# Altium schematic sheet Module_Tran_RF.SchDoc
size A
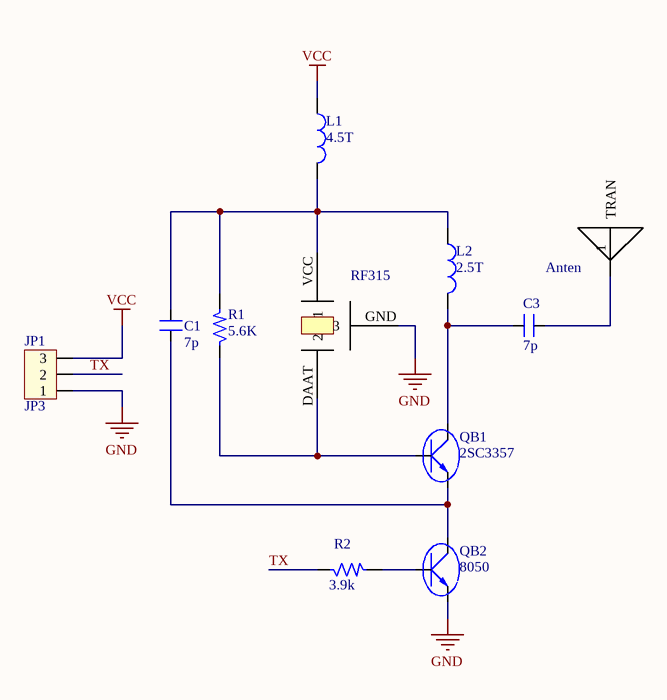
[diagram p0: Module_Tran_RF.SchDoc]

## Parts
C1  7p  [SM-0805]
C3  7p  [SM-0805]
JP1  JP3  [CON3]
L1  4.5T  [L/0.4]
L2  2.5T  [L/0.4]
QB1  2SC3357  [QTO-247]
QB2  8050  [QTO-247]
R1  5.6K  [SM-1206]
R2  3.9k  [SM-1206]
R?  Anten
SAW?  RF315

## Nets
GND: JP1.1 QB2.3(E) SAW?.GND(3)
VCC: JP1.3 L1.1
TX: JP1.2 R2.1
NetC1_1: C1.1 QB1.3(E) QB2.2(C)
NetC1_2: C1.2 L1.2 L2.1 R1.2 SAW?.VCC(1)
NetC3_1: C3.1 L2.2 QB1.2(C)
NetC3_2: C3.2 R?.1(TRAN)
NetQB1_1: QB1.1(B) R1.1 SAW?.DAAT(2)
NetQB2_1: QB2.1(B) R2.2

## Library data of the parts
C1 C3 = CM: Cap SMD; Value: 103
JP1 = Con3: Connector 3; Value: Connector 3
L1 L2 = L1: Inductor; Value: 150 mH
QB1 QB2 = D718: Transistor Power Supply; Value: D718
R1 R2 = R: Resistor 1/4W; Value: R1/4W - 1K